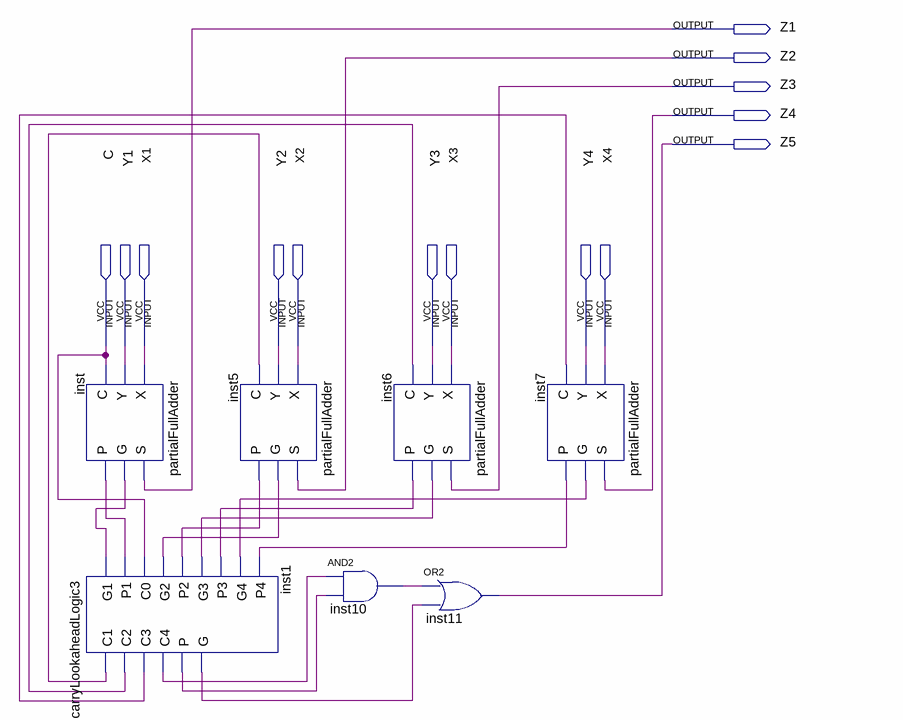
[diagram p0: schematic sheet]
// Quartus schematic CLA2.bdf as structural Verilog: 7 symbols, 14 pins
module CLA2 (
  input  C,
  input  Y1,
  input  X1,
  input  Y2,
  input  X2,
  input  Y3,
  input  X3,
  input  Y4,
  input  X4,
  output Z1,
  output Z2,
  output Z3,
  output Z4,
  output Z5
);

  wire inst1_c1, inst1_c2, inst1_c3, inst1_c4, inst1_g, inst1_p, inst5_g, inst5_p, inst6_g, inst6_p, inst7_g,
       inst7_p, inst10_out, inst_g, inst_p;

  partialFullAdder inst (.X(X1), .Y(Y1), .C(C), .S(Z1), .G(inst_g), .P(inst_p));
  carryLookaheadLogic3 inst1 (
    .G1(inst_g), .P1(inst_p), .C0(C), .G2(inst5_g), .P2(inst5_p), .G3(inst6_g), .P3(inst6_p), .G4(inst7_g),
    .P4(inst7_p), .C1(inst1_c1), .C2(inst1_c2), .C3(inst1_c3), .C4(inst1_c4), .P(inst1_p), .G(inst1_g));
  partialFullAdder inst5 (.X(X2), .Y(Y2), .C(inst1_c1), .S(Z2), .G(inst5_g), .P(inst5_p));
  and inst10 (inst10_out, inst1_c4, inst1_p);
  partialFullAdder inst6 (.X(X3), .Y(Y3), .C(inst1_c2), .S(Z3), .G(inst6_g), .P(inst6_p));
  or inst11 (Z5, inst10_out, inst1_g);
  partialFullAdder inst7 (.X(X4), .Y(Y4), .C(inst1_c3), .S(Z4), .G(inst7_g), .P(inst7_p));
endmodule
